# Altium schematic sheet CAN1.SchDoc
size 420 x 297 mm; SheetNumber: 19; SheetTotal: 21
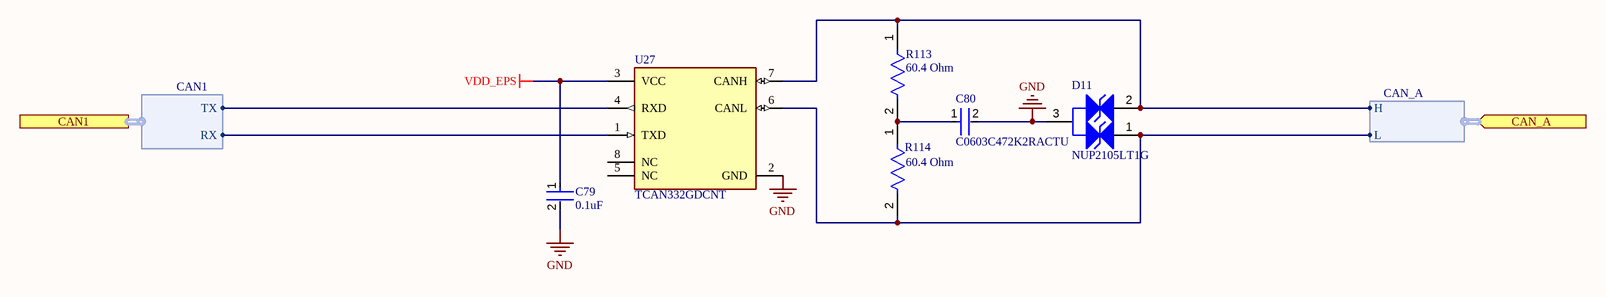
[diagram p0: CAN1.SchDoc]

## Parts
C79  0.1uF  [FP-C0603C-CF-MFG]
C80  C0603C472K2RACTU  [FP-C0603C-CF-MFG]
D11  NUP2105LT1G  [ONSC-SOT-23-3-318-08_V]
R113  60.4 Ohm  [FP-RC1608-IPC_C]
R114  60.4 Ohm  [FP-RC1608-IPC_C]
U27  TCAN332GDCNT  [FP-DCN0008A-IPC_C]

## Ports
CAN1 (harness CAN1), CAN_A (in, harness CAN_A)

## Harnesses
CAN_A: L, H
CAN1: TX, RX

## Nets
GND: C79.2 C80.2 D11.3(K) U27.2(GND)
VDD_EPS: C79.1 U27.3(VCC)
NetC80_1: C80.1 R113.2 R114.1
NetD11_1: D11.1(K) R114.2 U27.6(CANL) ; port CAN_A.L
NetD11_2: D11.2(K) R113.1 U27.7(CANH) ; port CAN_A.H
NetU27_1: U27.1(TXD) ; port CAN1.RX
NetU27_4: U27.4(RXD) ; port CAN1.TX

Not connected (* = marked no-connect by the designer): U27 5(NC) 8(NC)

## Notes on the sheet
- THIS DOCUMENT AND THE DATA DISCLOSED HEREIN OR
- HEREWITH IS THE PROPERTY OF ALTIUM LIMITED AND MAY
- DWG NO:
- REVISION
- REV:
- DESCRIPTION
- DATE
- APPROVED
- BE FREELY DISTRIBUTED IN WHOLE. NO RIGHTS ARE
- RESERVED OR EXPRESS OR IMPLIED WARANTEE GIVEN.
- ENG:
- APPROVALS
- PROJECT
- DSN:
- CHK:
- REFERENCE DOCUMENTS
- PROJECT REVISION:
- TITLE
- DOCUMENT REVISION:
- DESIGN ITEM:
- BOM:
- FAB DWG:
- PCB DWG:
- ASSY DWG:
- SCALE:
- A3
- SIZE
- CAGE CODE
- FILE NAME
- DWG NO.
- SHEET
- OF
- REV

## Library data of the parts
C79 = CMP-2006-03061-2: CAP CER 0.1UF 50V X7R 0603; Manufacturer: KEMET; Manufacturer Part Number: C0603C104K5RACTU; Tolerance: 0.1; Temperature Coefficient: 30ppm/°C; Material: Ceramic; Automotive Grade: Grade 1; Value: 0.10 μF; Temperature: -55°C to +125°C; RoHS: TRUE; Temperature Range High: +125°C; Lead Free: Yes; Octopart: https://octopart.com/c0603c104k5ractu-kemet-139244; Digikey Description: CAP CER 0.1UF 50V X7R 0603; Category: Cap; Package: C0603C-CF; ComponentLink2Description: Datasheet; Temperature Range Low: -55°C; Device Class L1: Passive Components; Voltage Rating: 50 V; Automotive: Yes; Device Class L3: Ceramic Capacitors; ComponentLink2URL: https://api.kemet.com/component-edge/download/datasheet/C0603C100J5GACAUTO.pdf; Capacitance: 0.10 μF; Device Class L2: Capacitors; Temperature Characteristic: X7R; Height: 0.87mm
C80 = CMP-2006-03218-2: CAP CER 4700PF 200V 10% X7R 0603; Manufacturer: KEMET; Capacitance: 4,700 pF; Material: Ceramic; Value: 4,700 pF; Automotive Grade: Grade 1; Temperature Coefficient: 30ppm/°C; Tolerance: 0.1; Manufacturer Part Number: C0603C472K2RACTU; Height: 0.87mm; Temperature Range High: +125°C; Package: C0603C-CF; Octopart: https://octopart.com/c0603c472k2ractu-kemet-17058096; Lead Free: Yes; Device Class L2: Capacitors; Automotive: Yes; Temperature Characteristic: X7R; RoHS: TRUE; Digikey Description: CAP CER 4700PF 200V 10% X7R 0603; Voltage Rating: 200 V; ComponentLink2URL: https://api.kemet.com/component-edge/download/datasheet/C0603C100J5GACAUTO.pdf; Device Class L3: Ceramic Capacitors; Temperature Range Low: -55°C; Category: Cap; Temperature: -55°C to +125°C; ComponentLink2Description: Datasheet; Device Class L1: Passive Components
D11 = CMP-1063-00164-1: Dual Line CAN Bus Protector, 3-Pin SOT-23, Pb-Free, Tape and Reel; Manufacturer: On Semiconductor; IR Max (uA): 0.1; Number of Lines: 2; Direction: Bidirectional; C Max (pF): 30; PPK Max (W): 350; V(BR) Min (V): 26.2; ComponentLink3URL: http://www.onsemi.cn/pub_link/Collateral/318-08.PDF; Mounting Technology: Surface Mount; ComponentLink2Description: Datasheet; PartNumber: NUP2105LT1G; ComponentLink1URL: http://www.onsemi.com/; PackageVersion: Rev. AP, 11/2009; DatasheetVersion: Rev. 5; RoHS: Pb-Free; PackageReference: SOT-23-3-318-08; ComponentLink2URL: http://www.onsemi.cn/pub_link/Collateral/NUP2105L-D.PDF; ComponentLink1Description: Manufacturer URL; PackageDescription: 3-Pin Small Outline Transistor, Body 2.92 x 1.3 mm, Pitch 0.95 mm; Packing: Tape and Reel; ComponentLink3Description: Package Specification
R113 R114 = CMP-13261-005441-1: Res Thick Film 0603 60.4Ω 1% 0.1W ±100ppm/°C Molded SMD T/R; Max Power Dissipation: 100mW; Resistance: 60.4R; Voltage Rating (DC): 50V; Case Code (Metric): 1608; Packaging: Tape and Reel; Max Operating Temperature: 155°C; Length: 0.063inch; Temperature Coefficient: 100ppm/°C; Contact Plating: Tin; Tolerance: 1%; Depth: 0.8mm; Case/Package: 0603; Features: Moisture Resistant; Number of Terminations: 2; Min Operating Temperature: -55°C; Power Rating: 100mW; Height: 0.022inch; Composition: Thick Film; Case Code (Imperial): 0603; Military Standard: Not; Radiation Hardening: No; Lead Free: Lead Free; Width: 0.031inch
U27 = CMP-04872-000198-1: IC TRANSCEIVER 1/1 SOT23-8; Min Supply Voltage: 3V; Max Supply Voltage: 3.6V; Interface: CAN; Packaging: Cut Tape; Max Operating Temperature: 125°C; RoHS Compliant: Yes; REACH SVHC: No SVHC; Min Operating Temperature: -40°C; Lead Free: Lead Free; Number of Pins: 8; Case/Package: SOT-23